# EAGLE design McPiFace-V1 (EAGLE 7.4.0)
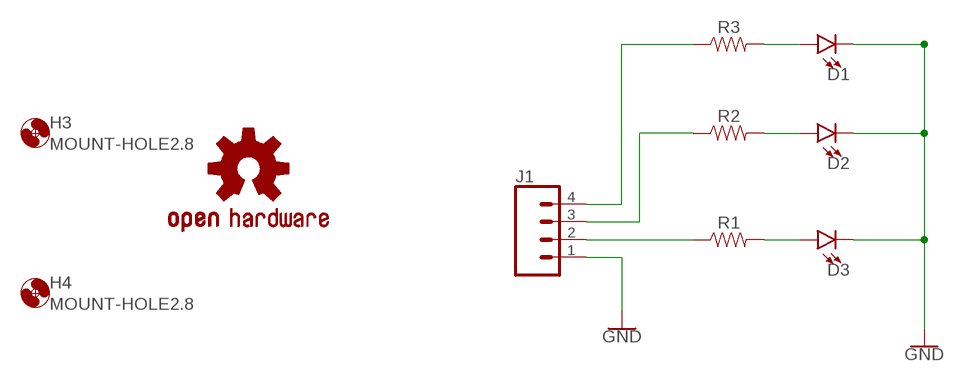
[diagram p0: schematic, sheet 1]

## Parts
D1  LED1206-BOTTOM-1.6MM  [LED-1206-BOTTOM-1.6MM]
D2  LED1206-BOTTOM-1.6MM  [LED-1206-BOTTOM-1.6MM]
D3  LED1206-BOTTOM-1.6MM  [LED-1206-BOTTOM-1.6MM]
H3  MOUNT-HOLE2.8  [2,8]
H4  MOUNT-HOLE2.8  [2,8]
J1  CONN_04SMD2  [1X04_1MM_RA]
LOGO1  OSHW-LOGOL  [OSHW-LOGO-L]
R1  RESISTOR1206  [1206]
R2  RESISTOR1206  [1206]
R3  RESISTOR1206  [1206]

## Nets
GND: D1.C D2.C D3.C J1.1
N$2: D1.A R3.2
N$3: D2.A R2.2
N$4: D3.A R1.2
N$5: J1.2 R1.1
N$6: J1.3 R2.1
N$7: J1.4 R3.1

## Library data of the parts
D1-D3 = ThingySticks:LED: LED (Generic) Standard schematic elements and footprints for 5mm, 3mm, 1206, and 0603 sized LEDs. Generic LEDs with no color specified.
H3 H4 = holes:MOUNT-HOLE: MOUNTING HOLE with drill center marker
J1 = SparkFun-Connectors:CONN_04: Multi connection point. Often used as Generic Header-pin footprint for 0.1 inch spaced/style header connections On any of the 0.1 inch spaced packages, you can populate with these: Break Away Headers - Straight <https://www.sparkfun.com/products/116> (PRT-00116) Break Away Male Headers - Right Angle <https://www.sparkfun.com/products/553> (PRT-00553) Female Headers <https://www.sparkfun.com/products/115> (PRT-00115) Break Away Headers - Machine Pin <https://www.sparkfun.com/products/117> (PRT-00117) Break Away Female Headers - Swiss Machine Pin <https://www.sparkfun.com/products/743> (PRT-00743) For SCREWTERMINALS and SPRING TERMINALS visit here: Screw Terimnals on SparkFun.com <https://www.sparkfun.com/search/results?term=Screw+Terminals> (5mm/3.5mm/2.54mm spacing) This device is also useful as a general connection point to wire up your design to another part of your project. Our various solder wires solder well into these plated through hole pads. Hook-Up Wire - Assortment (Stranded, 22 AWG) <https://www.sparkfun.com/products/11375> (PRT-11375) Hook-Up Wire - Assortment (Solid Core, 22 AWG) <https://www.sparkfun.com/products/11367> (PRT-11367) View the entire wire category on our website here <https://www.sparkfun.com/categories/141> Special notes: Molex polarized connector foot print use with SKU : PRT-08231 with associated crimp pins and housings. 1MM SMD Version SKU: PRT-10208; PROD_ID: CONN-10310; SF_ID: PRT-10208
LOGO1 = SparkFun-Aesthetics:OSHW-LOGO: Open-Source Hardware (OSHW) Logo This logo indicates the piece of hardware it is found on incorporates a OSHW license and/or adheres to the definition of open source hardware found here: http://freedomdefined.org/OSHW
R1-R3 = SparkFun-Resistors:RESISTOR: Generic Resistor Package

## Board
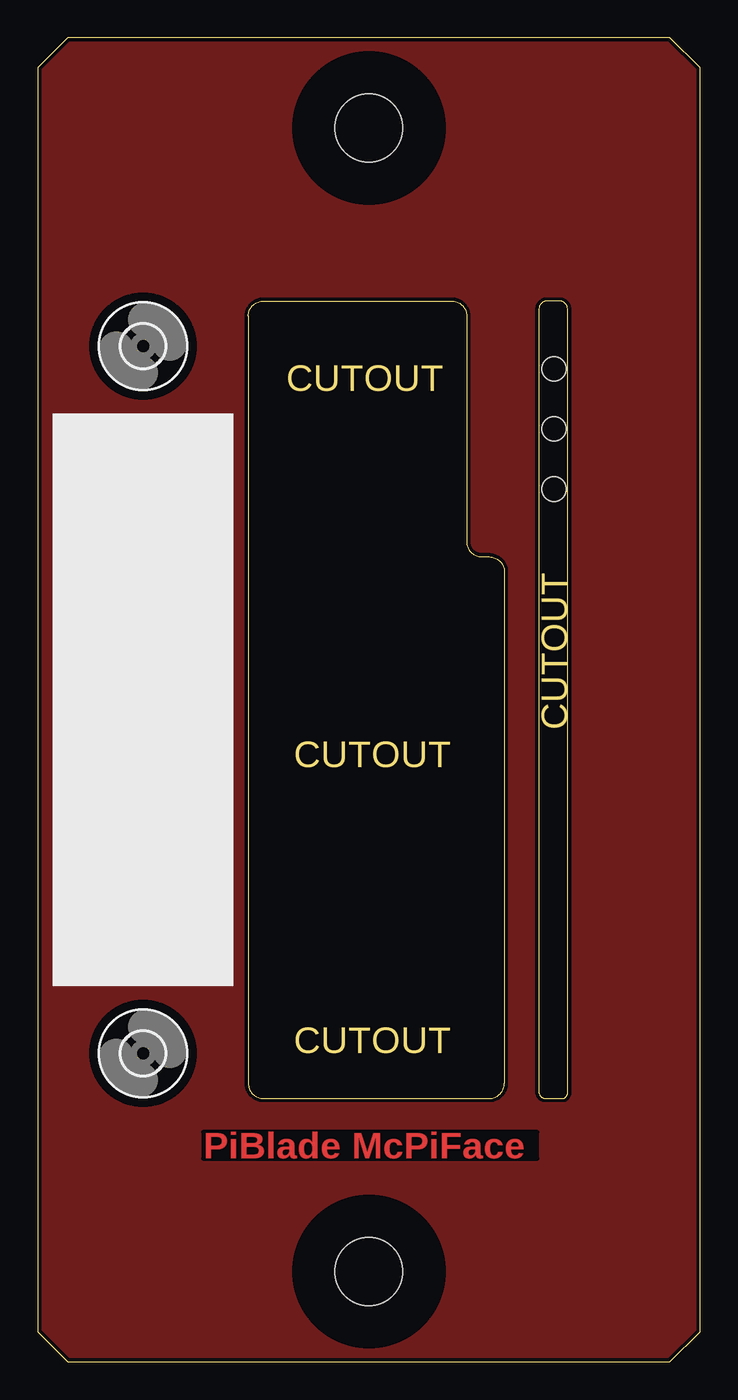
[diagram p1: board, top side]
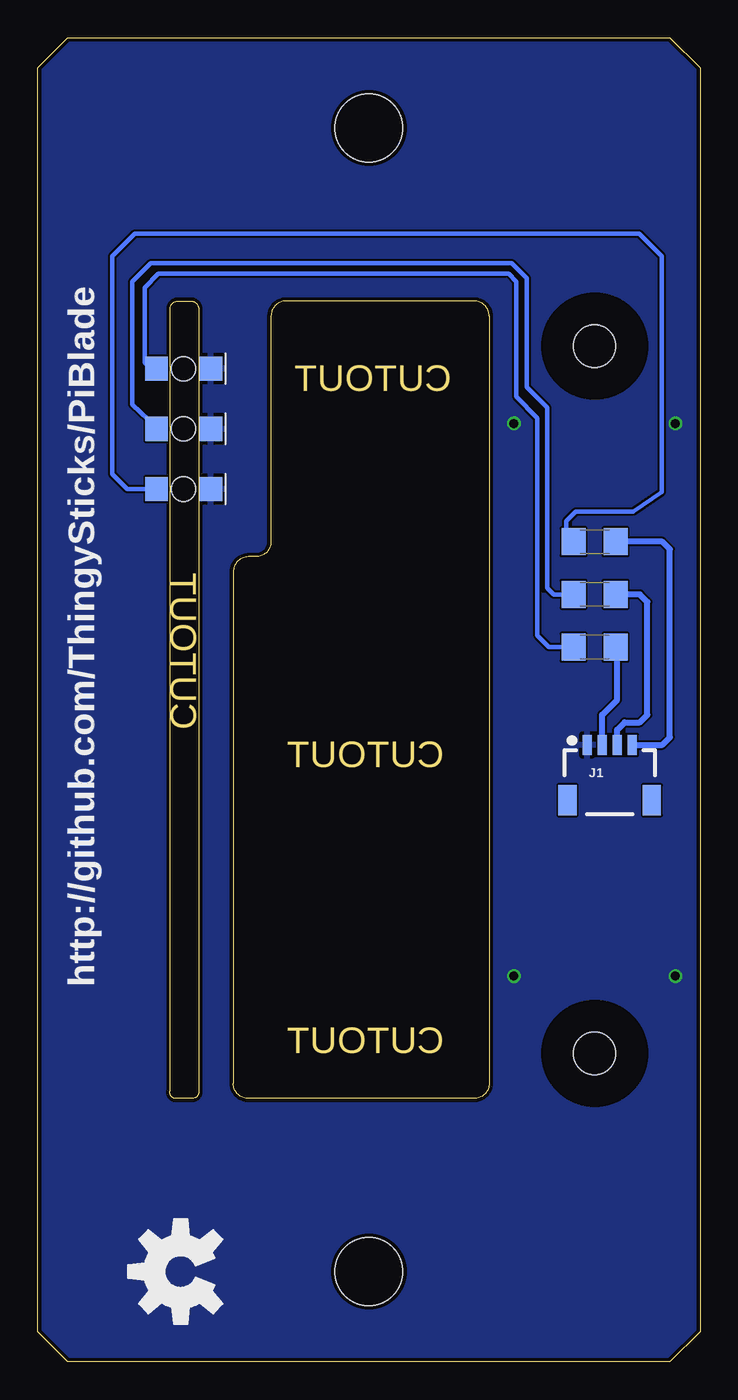
[diagram p2: board, bottom side, seen from below]

Size 44 x 88 mm. Coordinates in mm from the lower left corner, seen from the top.
Outline: 2,0 42,0 44,2 44,86 42,88 2,88 0,86 0,2 2,0
Outline: 14,69.5 14,18.5 arc90 15,17.5 30,17.5 arc90 31,18.5 31,52.5 arc90 30,53.5 29.5,53.5 arc-90 28.5,54.5 28.5,69.5 arc90 27.5,70.5 15,70.5 arc90 14,69.5
Outline: 33.3,18 arc90 33.7,17.5 34.9,17.5 arc90 35.2,18 35.2,70 arc90 34.6,70.5 33.8,70.5 arc90 33.3,69.9 33.3,18
Copper layers (1*16): Top 0.035mm / dielectric 1.5mm / Bottom 0.035mm
Design rules "dirt_cheap_dirty_boards.v1": minimum track width 5mil, minimum drill 12mil, track to track 5mil, track to pad 5mil, pad to pad 5mil, via to via 5mil, smd to smd 0mil, copper to edge 10mil, drill to drill 10mil, minimum pad ring 10mil, minimum via ring 6mil, stop-mask expansion 2mil, vias tented up to drill 25mil, thermal gap 10mil
Holes 4.5 mm at 22,6 22,82
tRestrict: area 17,77 to 27,87; area 17,1 to 27,11

### Footprints (pad centres in the part's own frame; a part is rotated, then mirrored left to right if it is on the bottom)
LED-1206-BOTTOM-1.6MM = smd 1.5 x 1.6: A -1.8,0; C 1.8,0 | hole 1.6: 0,0
2,8 = hole 2.8: 0,0
1X04_1MM_RA = smd 0.6 x 1.35: 1 -1.5,0; 2 -0.5,0; 3 0.5,0; 4 1.5,0 | smd 1.2 x 2: NC1 2.8,-3.675; NC2 -2.8,-3.675
1206 = smd 1.6 x 1.8: 1 -1.4,0; 2 1.4,0

### Placement (x,y rotation side)
D1  34.3,58 0 bottom
D2  34.3,62 0 bottom
D3  34.3,66 0 bottom
H3  7,20.5 0 top
H4  7,67.5 0 top
J1  6,41 0 bottom
LOGO1  34.5,6 90 bottom
R1  7,47.5 180 bottom
R2  7,51 180 bottom
R3  7,54.5 180 bottom

### Tracks (layer width: path | path; a pad name or v marks a point on that pad's centre or on a via)
GND  (via drill 0.6, 0.6 pad 0.25)
  other vias: 1.64,62.37 12.37,62.37 1.64,25.64 12.37,25.64
  pour Top: -1,88.5 45,88.5 45,-1 -1,-1
  pour Bottom: -1,88.5 45,88.5 45,-1 -1,-1
N$2
  Bottom 0.305: D1.A 38.03,58 39.03,59 39.03,73.47 37.53,74.97 4.04,74.97 2.54,73.47 2.54,57.78 4.45,56.52 8.26,56.52 8.89,55.88 8.89,54.5 R3.2
N$3
  Bottom 0.305: 36.1,62.1 37.7,63.6 37.7,71.8 36.5,73 12.5,73 11.5,72 11.5,64.77 10.16,63.43 10.16,51.44 9.72,51 R2.2
  Bottom 0.406: D2.A 36.1,62.1
N$4
  Bottom 0.305: 36.5,66 36.9,66.4 36.9,71.4 36,72.3 12.7,72.3 12.2,71.8 12.2,64.14 10.79,62.73 10.79,48.26 10.04,47.5 R1.2
  Bottom 0.406: 35.9,66 D3.A 36.5,66
N$5
  Bottom 0.406: J1.2 6.5,43 5.5,44 5.5,47.4 R1.1
N$6
  Bottom 0.406: J1.3 5.5,42 5,42.5 4,42.5 3.5,43 3.5,50.5 4,51 R2.1
N$7
  Bottom 0.406: J1.4 2.5,41 2,41.5 2,54 2.5,54.5 R3.1

### Text on the board
Top: PiBlade McPiFace
Dimension: CUTOUT | CUTOUT | CUTOUT | CUTOUT
bNames: http://github.com/ThingySticks/PiBlade